# Altium schematic sheet phase_logic.SchDoc
size A4; SheetNumber: 3; SheetTotal: 5
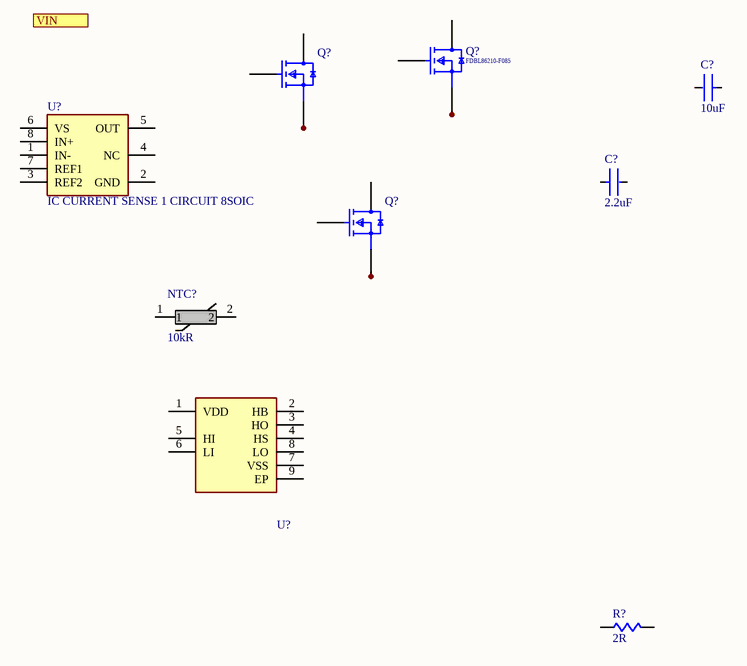
[diagram p0: phase_logic.SchDoc]

## Parts
(Parts that share a designator on the sheet are numbered #1, #2 ... from top to bottom, then left to right.)
C?#1  value 10uF  [FP-CL31-IPC_C]  (hidden comment: SCER 10UF 25V X7R 1206)
C?#2  value 2.2uF  [FP-GCJ32D-0_4-IPC_C]  (hidden comment: SCER 2.2UF 100V X7R 1210)
NTC?  value 10kR  [NTCS0603_VIS]  (hidden comment: NTC Thermistor 10k 0603 (1608 Metric))
Q?#1  N-CH 150V 169A 8HPSOF  [FP-100CU-MFG]  (value not drawn)
Q?#2  N-CH 150V 169A 8HPSOF  [FP-100CU-MFG]  (value not drawn)
Q?#3  N-CH 150V 169A 8HPSOF  [FP-100CU-MFG]  (value not drawn)
R?  value 2R  (hidden comment: RES 2 OHM 5% 1/10W 0603)
U?#1  IC CURRENT SENSE 1 CIRCUIT 8SOIC  [FP-D0008A-IPC_C]
U?#2  IC GATE DRVR HALF-BRIDGE 8SOPWR  [SOIC127P600X170-9N]  (value not drawn)

## Ports
VIN (in, see Half_Bridge[1A], Power[2A])

## Nets
NetQ?#1_2: Q?#1.2(S) Q?#1.3(S) Q?#1.4(S) Q?#1.5(S) Q?#1.6(S) Q?#1.7(S) Q?#1.8(S)
NetQ?#2_2: Q?#2.2(S) Q?#2.3(S) Q?#2.4(S) Q?#2.5(S) Q?#2.6(S) Q?#2.7(S) Q?#2.8(S)
NetQ?#3_2: Q?#3.2(S) Q?#3.3(S) Q?#3.4(S) Q?#3.5(S) Q?#3.6(S) Q?#3.7(S) Q?#3.8(S)

Not connected (* = marked no-connect by the designer): C?#1 1 2; C?#2 1 2; NTC? 1 2; Q?#1 1(G) 9(D); Q?#2 1(G) 9(D); Q?#3 1(G) 9(D); R? 1 2; U?#1 1(IN-) 2(GND) 3(REF2) 4(NC) 5(OUT) 6(VS) 7(REF1) 8(IN+); U?#2 1(VDD) 2(HB) 3(HO) 4(HS) 5(HI) 6(LI) 7(VSS) 8(LO) 9(EP)

## Library data of the parts
C?#1 = CL31B106KAHVPNE: CER 10UF 25V X7R 1206; Manufacturer: Samsung; Dielectric Material: Ceramic; Multilayer: Yes; Tolerance  (fill in as +-): 10%; Reference Standard: AEC-Q200; Supplier: Digi-Key; Supplier Part Number: 1276-6814-1-ND; Manufacturer Part Number: CL31B106KAHVPNE; RoHS: Yes; Category: Ceramic Capacitors; Stock: 960621; Pricing: 1=0.44, 10=0.314, 50=0.2376, 100=0.2069, 500=0.15324, 1000=0.13025 (USD); Mounting Technology: Surface Mount; Pins: 2; Package Shape: Rectangular; Case/Package: 1206; Terminal Finish: Nickel; Min Operating Temperature: -55°C; Max Operating Temperature: 125°C; JESD-609 Code: e3; Capacitor Type: Ceramic; Packaging: Tape and Reel; Tolerance (fill in as +-): 10%; Rated DC Voltage (URdc): 25V; Temperature Characteristics Code: X7R; Termination: Wraparound; Reach SVHC Compliant: Yes; RoHS Compliant: Yes; ComponentLink1URL: https://datasheet.ciiva.com:443/pdfs/VipMasterIC/IC/SEMS/SEMS-S-A0009022704/SEMS-S-A0009023146-1.pdf?src-supplier=IHS+Markit; ComponentLink1Description: https://datasheet.ciiva.com:443/pdfs/VipMasterIC/IC/SEMS/SEMS-S-A0009022704/SEMS-S-A0009023146-1.pdf?src-supplier=IHS+Markit; ComponentLink2URL: http://www.samsungsem.com/kr/support/product-search/mlcc/CL31B106KAHVPNE.jsp?src-supplier=Digi-Key; ComponentLink2Description: http://www.samsungsem.com/kr/support/product-search/mlcc/CL31B106KAHVPNE.jsp?src-supplier=Digi-Key; ComponentLink3URL: http://www.samsungsem.com/kr/support/library/product-catalog/mlcc.jsp?src-supplier=Digi-Key; ComponentLink3Description: http://www.samsungsem.com/kr/support/library/product-catalog/mlcc.jsp?src-supplier=Digi-Key
C?#2 = GCJ32DR72A225KA01L: CER 2.2UF 100V X7R 1210; Manufacturer: Murata; Dielectric Material: Ceramic; Multilayer: Yes; Tolerance  (fill in as +-): 10%; Reference Standard: AEC-Q200; Supplier: Digi-Key; Supplier Part Number: 490-5840-1-ND; Manufacturer Part Number: GCJ32DR72A225KA01L; RoHS: Yes; Category: Ceramic Capacitors; Stock: 318636; Pricing: 1=1.74, 10=1.375, 50=1.1914, 100=1.031, 500=0.779 (USD); Mounting Technology: Surface Mount; Pins: 2; Package Shape: Rectangular; Case/Package: 1210; Terminal Finish: Nickel; Min Operating Temperature: -55°C; Max Operating Temperature: 125°C; JESD-609 Code: e3; Capacitor Type: Ceramic; Package Style: SMTMeter; Packaging: Tape and Reel; Tolerance (fill in as +-): 10%; Rated DC Voltage (URdc): 100V; Temperature Characteristics Code: X7R; Termination: Wraparound; Length: 3.2mm; Width: 2.5mm; Height: 2mm; Reach SVHC Compliant: Yes; RoHS Compliant: Yes; ComponentLink1URL: https://psearch.en.murata.com:443/capacitor/product/GCJ32DR72A225KA01%23.pdf?src-supplier=IHS+Markit; ComponentLink1Description: https://psearch.en.murata.com:443/capacitor/product/GCJ32DR72A225KA01%23.pdf?src-supplier=IHS+Markit; ComponentLink2URL: https://datasheet.ciiva.com/175/s0717e-175728.pdf?src-supplier=Digi-Key; ComponentLink2Description: https://datasheet.ciiva.com/175/s0717e-175728.pdf?src-supplier=Digi-Key; ComponentLink3URL: https://datasheet.ciiva.com/175/s0717e-175727.pdf?src-supplier=Digi-Key; ComponentLink3Description: https://datasheet.ciiva.com/175/s0717e-175727.pdf?src-supplier=Digi-Key; ComponentLink4URL: https://datasheet.ciiva.com/175/s0717e-175729.pdf?src-supplier=Digi-Key; ComponentLink4Description: https://datasheet.ciiva.com/175/s0717e-175729.pdf?src-supplier=Digi-Key
NTC? = NTCS0603E3103FLT: Manufacturer: Vishay BCcomponents; Tolerance: 1%; Power: 125mW; Rated Temperature: 25°C; Thermistor Application: OVERLOAD PROTECTION; Supplier: Digi-Key; Supplier Part Number: BC2737CT-ND; Manufacturer Part Number: NTCS0603E3103FLT; RoHS: No; Category: Thermistors; Stock: 145210; Pricing: 1=1.08, 5=1.024, 10=0.892, 25=0.7832, 50=0.6506, 100=0.5543, 500=0.48198, 1000=0.42173 (USD); Mounting Technology: Surface Mount; Pins: 2; Package Shape: Rectangular; Terminal Finish: Tin; Min Operating Temperature: -40°C; Max Operating Temperature: 150°C; JESD-609 Code: e3; Packaging: Tape and Reel; Termination: Wraparound; Resistor Type: NTC THERMISTOR; Manufacturer Series: NTCS0603E3103FLT; Terminal Placement: Dual Ended; ComponentLink1URL: https://datasheet.ciiva.com:443/pdfs/VipMasterIC/IC/BEYS/BEYSS04817/BEYSS04817-1.pdf?src-supplier=IHS+Markit; ComponentLink1Description: https://datasheet.ciiva.com:443/pdfs/VipMasterIC/IC/BEYS/BEYSS04817/BEYSS04817-1.pdf?src-supplier=IHS+Markit; ComponentLink2URL: https://datasheet.ciiva.com/2848/ntcs0603-2848830.pdf?src-supplier=Digi-Key; ComponentLink2Description: https://datasheet.ciiva.com/2848/ntcs0603-2848830.pdf?src-supplier=Digi-Key; ComponentLink3URL: https://datasheet.ciiva.com/2848/ntcs0603-2848831.pdf?src-supplier=Digi-Key; ComponentLink3Description: https://datasheet.ciiva.com/2848/ntcs0603-2848831.pdf?src-supplier=Digi-Key; ComponentLink4URL: https://datasheet.ciiva.com/2848/ntcs0603-2848829.pdf?src-supplier=Digi-Key; ComponentLink4Description: https://datasheet.ciiva.com/2848/ntcs0603-2848829.pdf?src-supplier=Digi-Key
Q?#1-Q?#3 = FDBL86210-F085: Manufacturer: ON Semiconductor; Polarity/Channel Type: N-CHANNEL; FET Technology: METAL-OXIDE SEMICONDUCTOR; Power Dissipation-Max (Abs): 500W; Supplier: Digi-Key; Supplier Part Number: FDBL86210-F085CT-ND; RoHS: Yes; Category: MOSFETs; Stock: 9997; Pricing: 1=6.08, 10=5.463, 100=4.4761, 500=3.81042, 1000=3.2136 (USD); Terminal Finish: Tin; Max Operating Temperature: 175°C; Drain Current-Max (Abs) (ID): 169A; Moisture Sensitivity Level: 1; Surface Mount: Yes; JESD-609 Code: e3; RoHS Compliant: Yes; Reach SVHC Compliant: No; ComponentLink1URL: https://datasheet.ciiva.com:443/pdfs/VipMasterIC/IC/ONSM/ONSM-S-A0003157691/ONSM-S-A0003586469-1.pdf?src-supplier=IHS+Markit; ComponentLink1Description: https://datasheet.ciiva.com:443/pdfs/VipMasterIC/IC/ONSM/ONSM-S-A0003157691/ONSM-S-A0003586469-1.pdf?src-supplier=IHS+Markit; ComponentLink2URL: http://www.farnell.com/datasheets/2859346.pdf?src-supplier=Farnell; ComponentLink2Description: http://www.farnell.com/datasheets/2859346.pdf?src-supplier=Farnell; ComponentLink3URL: http://www.onsemi.com/pub/Collateral/FDBL86210_F085-D.PDF?src-supplier=Digi-Key; ComponentLink3Description: http://www.onsemi.com/pub/Collateral/FDBL86210_F085-D.PDF?src-supplier=Digi-Key; ComponentLink4URL: http://www.farnell.com/datasheets/2859346.pdf?src-supplier=Element14; ComponentLink4Description: http://www.farnell.com/datasheets/2859346.pdf?src-supplier=Element14; ComponentLink5URL: http://www.farnell.com/datasheets/2859346.pdf?src-supplier=Newark; ComponentLink5Description: http://www.farnell.com/datasheets/2859346.pdf?src-supplier=Newark; Manufacturer Part Number: FDBL86210-F085
R? = RMCF0603JT2R00: Manufacturer: Stackpole Electronics; Power: 100mW; Rated Temperature: 70°C; Temperature Coefficient: 200ppm/°C; Working Voltage: 75V; Package Height: 0.45mm; Package Length: 1.55mm; Package Width: 0.8mm; Reference Standard: AEC-Q200; Supplier: Digi-Key; Supplier Part Number: RMCF0603JT2R00CT-ND; Manufacturer Part Number: RMCF0603JT2R00; RoHS: Yes; Category: Chip SMD Resistors; Stock: 118386; Pricing: 1=0.1, 10=0.019, 50=0.0114, 100=0.0094, 500=0.00628, 1000=0.00536 (USD); Mounting Technology: Surface Mount; Pins: 2; Package Shape: Rectangular; Case/Package: 0603; Terminal Finish: Nickel; Min Operating Temperature: -55°C; Max Operating Temperature: 155°C; Tolerance: 5%; JESD-609 Code: e3; Resistor Type: FIXED RESISTOR; Construction: Rectangular; Package Style: SMTMeter; Packaging: Tape and Reel; Technology: METAL GLAZE/THICK FILM; Termination: Wraparound; Reach SVHC Compliant: Yes; RoHS Compliant: Yes; ComponentLink1URL: https://datasheet.ciiva.com:443/pdfs/VipMasterIC/IC/SEIE/SEIE-S-A0009541969/SEIE-S-A0009541969-1.pdf?src-supplier=IHS+Markit; ComponentLink1Description: https://datasheet.ciiva.com:443/pdfs/VipMasterIC/IC/SEIE/SEIE-S-A0009541969/SEIE-S-A0009541969-1.pdf?src-supplier=IHS+Markit; ComponentLink2URL: https://www.seielect.com/Catalog/SEI-RMCF_RMCP.pdf?src-supplier=Digi-Key; ComponentLink2Description: https://www.seielect.com/Catalog/SEI-RMCF_RMCP.pdf?src-supplier=Digi-Key; ComponentLink3URL: https://www.seielect.com/catalog/SEI-Packaging.pdf?src-supplier=Digi-Key; ComponentLink3Description: https://www.seielect.com/catalog/SEI-Packaging.pdf?src-supplier=Digi-Key; ComponentLink4URL: https://www.seielect.com/catalog/SEI-RMCF_RMCP.pdf?src-supplier=Avnet; ComponentLink4Description: https://www.seielect.com/catalog/SEI-RMCF_RMCP.pdf?src-supplier=Avnet
U?#1 = INA240A1EDRQ1: Manufacturer: Texas Instruments; Throw Configuration: ANALOG CIRCUIT; Supplier: Digi-Key; Supplier Part Number: 296-53152-1-ND; Manufacturer Part Number: INA240A1EDRQ1; RoHS: Yes; Category: Amplifiers - Op Amps, Buffer, Instrumentation; Stock: 7107; Pricing: 1=4.22, 10=3.79, 25=3.5828, 100=3.1051, 250=2.94592, 500=2.64336, 1000=2.22933 (USD); Reach SVHC Compliant: Yes; RoHS Compliant: Yes; ComponentLink1URL: https://www.ti.com:443/lit/ds/symlink/ina240-q1.pdf?src-supplier=IHS+Markit; ComponentLink1Description: https://www.ti.com:443/lit/ds/symlink/ina240-q1.pdf?src-supplier=IHS+Markit
U?#2 = UCC27212AQDDARQ1: Half Bridge Based MOSFET Driver, 4A, PDSO8; Manufacturer: Texas Instruments; Supplier: Digi-Key; Supplier Part Number: 296-48223-1-ND; Manufacturer Part Number: UCC27212AQDDARQ1; RoHS: Yes; Category: Integrated Circuits (ICs); Stock: 4685; Pricing: 1=4.89, 10=4.39, 25=4.1508, 100=3.5972, 250=3.41276, 500=3.06226, 1000=2.58262 (USD); Interface IC Type: HALF BRIDGE BASED MOSFET DRIVER; Moisture Sensitivity Level: 2; Reach SVHC Compliant: Yes; RoHS Compliant: Yes; ComponentLink1URL: https://www.ti.com:443/lit/ds/symlink/ucc27212a-q1.pdf?src-supplier=IHS+Markit; ComponentLink1Description: https://www.ti.com:443/lit/ds/symlink/ucc27212a-q1.pdf?src-supplier=IHS+Markit; ComponentLink2URL: http://www.ti.com/lit/ds/symlink/ucc27212a-q1.pdf?src-supplier=Digi-Key; ComponentLink2Description: http://www.ti.com/lit/ds/symlink/ucc27212a-q1.pdf?src-supplier=Digi-Key